# EAGLE design Modulo_shield_L6470-28 (EAGLE 7.6.0)
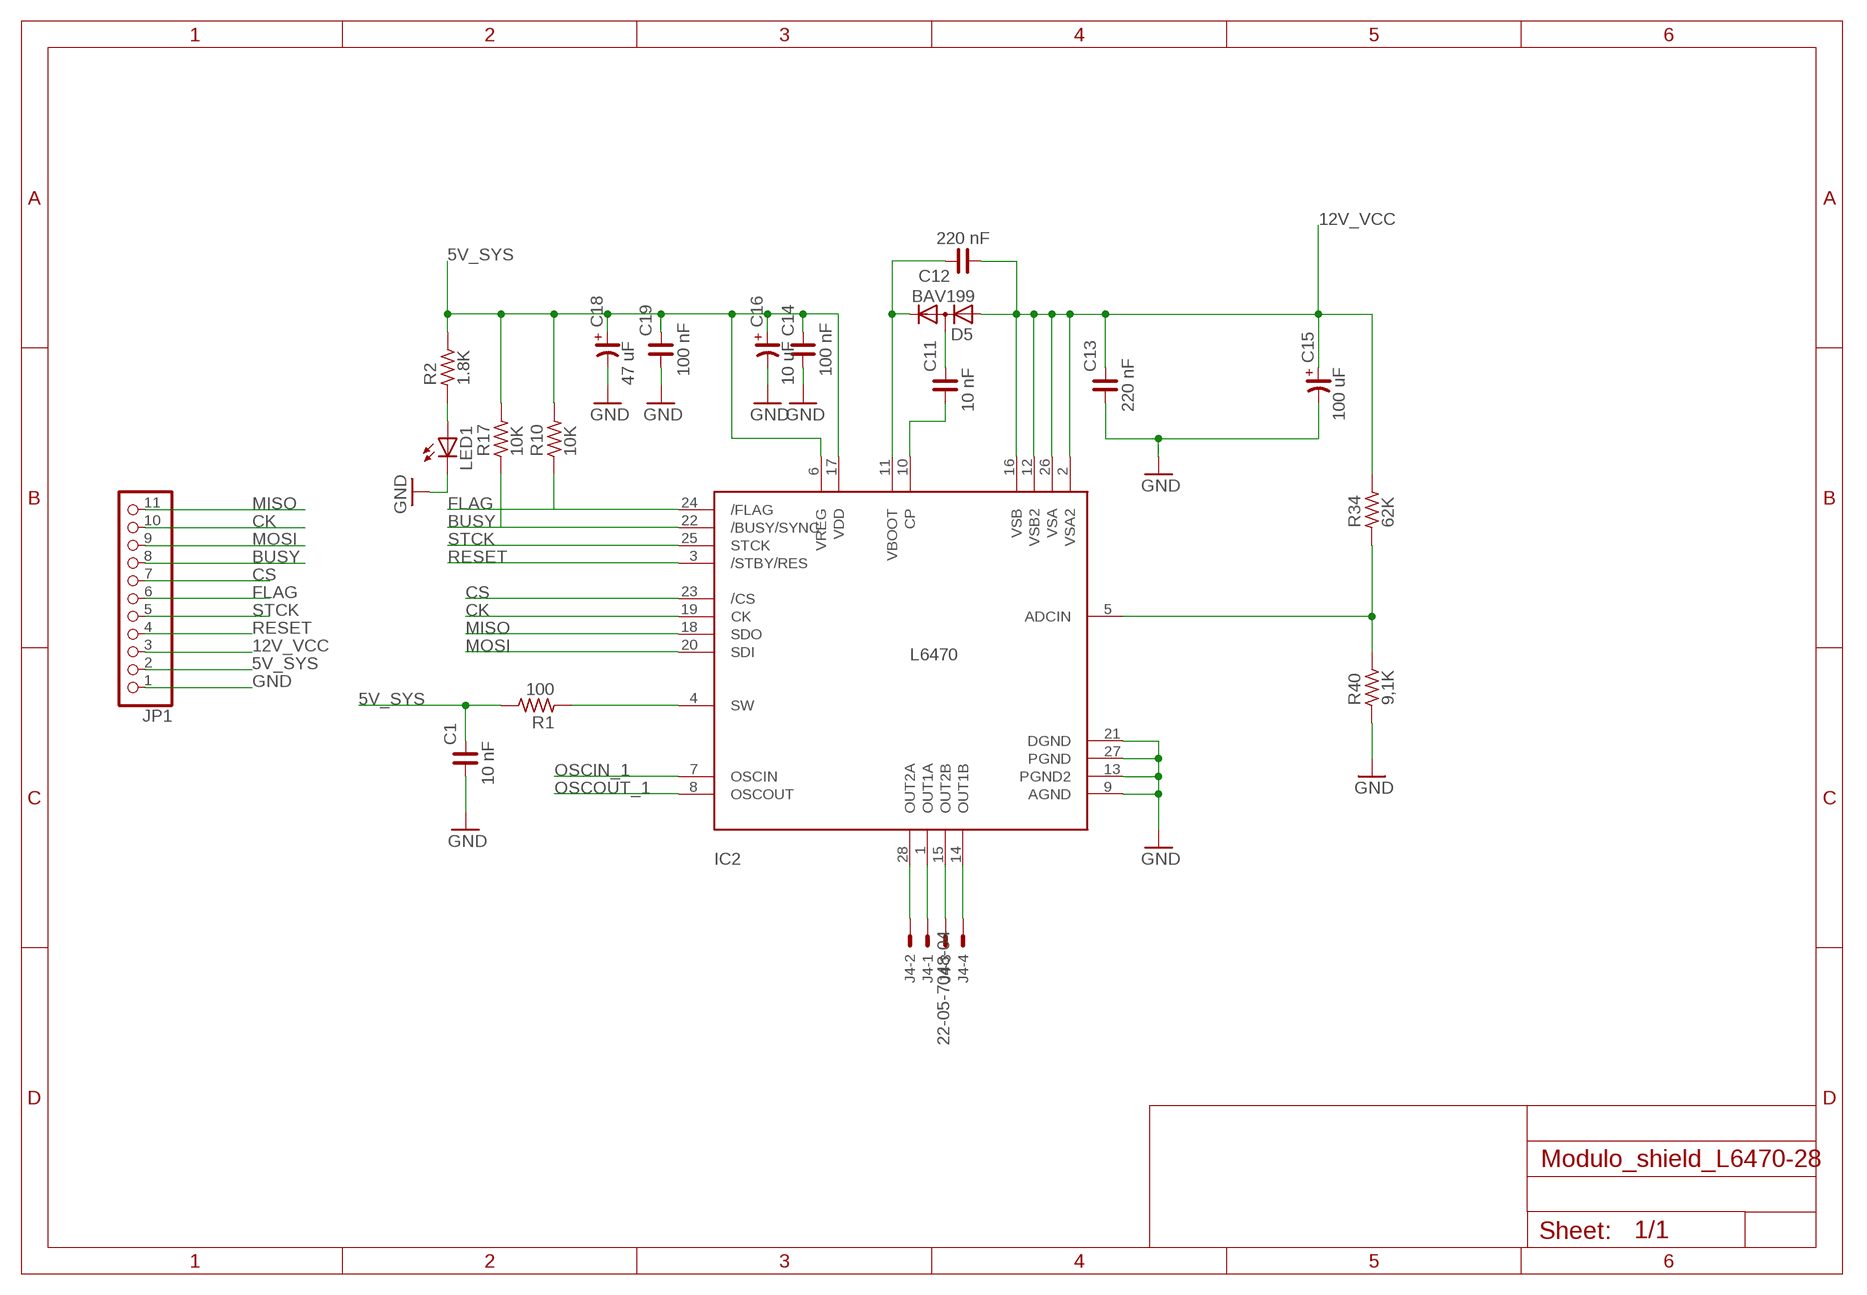
[diagram p0: schematic, sheet 1]

## Parts
C1  10 nF  C_1206  [C1206]
C11  10 nF  C_1206  [C1206]
C12  220 nF  C_1206  [C1206]
C13  220 nF  C_1206  [C1206]
C14  100 nF  C_1206  [C1206]
C15  100 uF  CP_SV-D  [CSV-D]
C16  10 uF  CP_SV-B  [CSV-B]
C18  47 uF  CP_SV-B  [CSV-B]
C19  100 nF  C_1206  [C1206]
D5  BAV199  [SOT23]
IC2  L6470  [HTSSOP28]
J4  22-05-7048-04  [7395-04]
JP1  PINHD-1X11/90  [1X11/90]
LED1  LEDCHIPLED_1206  [CHIPLED_1206]
R1  100  R_1206  [R1206]
R2  1.8K  R_1206  [R1206]
R10  10K  R_1206  [R1206]
R17  10K  R_1206  [R1206]
R34  62K  R_1206  [R1206]
R40  9,1K  R_1206  [R1206]

## Nets
5V_SYS: C1.2 C14.2 C16.+ C18.+ C19.2 IC2.6(VREG) IC2.17(VDD) JP1.2 R1.2 R2.2 R10.2 R17.2
12V_VCC: C12.1 C13.2 C15.+ D5.1(A) IC2.2(VSA2) IC2.12(VSB2) IC2.16(VSB) IC2.26(VSA) JP1.3 R34.2
A1: IC2.1(OUT1A) J4.1
A2: IC2.28(OUT2A) J4.2
BUSY: IC2.22(/BUSY/SYNC) JP1.8 R17.1
CK: IC2.19(CK) JP1.10
CS: IC2.23(/CS) JP1.7
FLAG: IC2.24(/FLAG) JP1.6 R10.1
GND: C1.1 C13.1 C14.1 C15.- C16.- C18.- C19.1 IC2.9(AGND) IC2.13(PGND2) IC2.21(DGND) IC2.27(PGND) JP1.1 LED1.C R40.1
MISO: IC2.18(SDO) JP1.11
MOSI: IC2.20(SDI) JP1.9
N$1: IC2.4(SW) R1.1
N$2: IC2.15(OUT2B) J4.3
N$3: IC2.14(OUT1B) J4.4
N$5: C11.2 D5.3(AC)
N$7: C11.1 IC2.10(CP)
N$16: LED1.A R2.1
N$48: IC2.5(ADCIN) R34.1 R40.2
OSCIN_1: IC2.7(OSCIN)
OSCOUT_1: IC2.8(OSCOUT)
RESET: IC2.3(/STBY/RES) JP1.4
STCK: IC2.25(STCK) JP1.5
VBOOT_1: C12.2 D5.2(C) IC2.11(VBOOT)

## Library data of the parts
C1 C11-C14 C19 = tesis-master-smd:C_: NON-POLARIZED CAP
C15 C16 C18 = tesis-master-smd:CP_: POLARIZED CAP
D5 = diode:BAV199: DIODE low-leakage double diode
IC2 = tesis-Reprap:L6470: Fully integrated microstepping motor driver with motion engine and SPI
J4 = tesis-Replicape_B3:22-?-04: CONNECTOR wire to board 2.54 mm (.1 inch) pitch header; OC_FARNELL: unknown; OC_NEWARK: unknown
JP1 = pinhead:PINHD-1X11: PIN HEADER
LED1 = tesis-Replicape_B3:LED: LED OSRAM: - CHIPLED LG R971, LG N971, LY N971, LG Q971, LY Q971, LO R971, LY R971 LH N974, LH R974 LS Q976, LO Q976, LY Q976 LO Q996 - Hyper CHIPLED LW Q18S LB Q993, LB Q99A, LB R99A - SideLED LS A670, LO A670, LY A670, LG A670, LP A670 LB A673, LV A673, LT A673, LW A673 LH A674 LY A675 LS A676, LA A676, LO A676, LY A676, LW A676 LS A679, LY A679, LG A679 - Hyper Micro SIDELED® LS Y876, LA Y876, LO Y876, LY Y876 LT Y87S - SmartLED LW L88C, LW L88S LB L89C, LB L89S, LG L890 LS L89K, LO L89K, LY L89K LS L896, LA L896, LO L896, LY L896 - TOPLED LS T670, LO T670, LY T670, LG T670, LP T670 LSG T670, LSP T670, LSY T670, LOP T670, LYG T670 LG T671, LOG T671, LSG T671 LB T673, LV T673, LT T673, LW T673 LH T674 LS T676, LA T676, LO T676, LY T676, LB T676, LH T676, LSB T676, LW T676 LB T67C, LV T67C, LT T67C, LS T67K, LO T67K, LY T67K, LW E67C LS E67B, LA E67B, LO E67B, LY E67B, LB E67C, LV E67C, LT E67C LW T67C LS T679, LY T679, LG T679 LS T770, LO T770, LY T770, LG T770, LP T770 LB T773, LV T773, LT T773, LW T773 LH T774 LS E675, LA E675, LY E675, LS T675 LS T776, LA T776, LO T776, LY T776, LB T776 LHGB T686 LT T68C, LB T68C - Hyper Mini TOPLED® LB M676 - Mini TOPLED Santana® LG M470 LS M47K, LO M47K, LY M47K Source: http://www.osram.convergy.de LUXEON: - LUMILED® LXK2-PW12-R00, LXK2-PW12-S00, LXK2-PW14-U00, LXK2-PW14-V00 LXK2-PM12-R00, LXK2-PM12-S00, LXK2-PM14-U00 LXK2-PE12-Q00, LXK2-PE12-R00, LXK2-PE12-S00, LXK2-PE14-T00, LXK2-PE14-U00 LXK2-PB12-K00, LXK2-PB12-L00, LXK2-PB12-M00, LXK2-PB14-N00, LXK2-PB14-P00, LXK2-PB14-Q00 LXK2-PR12-L00, LXK2-PR12-M00, LXK2-PR14-Q00, LXK2-PR14-R00 LXK2-PD12-Q00, LXK2-PD12-R00, LXK2-PD12-S00 LXK2-PH12-R00, LXK2-PH12-S00 LXK2-PL12-P00, LXK2-PL12-Q00, LXK2-PL12-R00 Source: www.luxeon.com KINGBRIGHT: KA-3528ASYC Source: www.kingbright.com
R1 R2 R10 R17 R34 R40 = tesis-master-smd:R_: RESISTOR

## Board
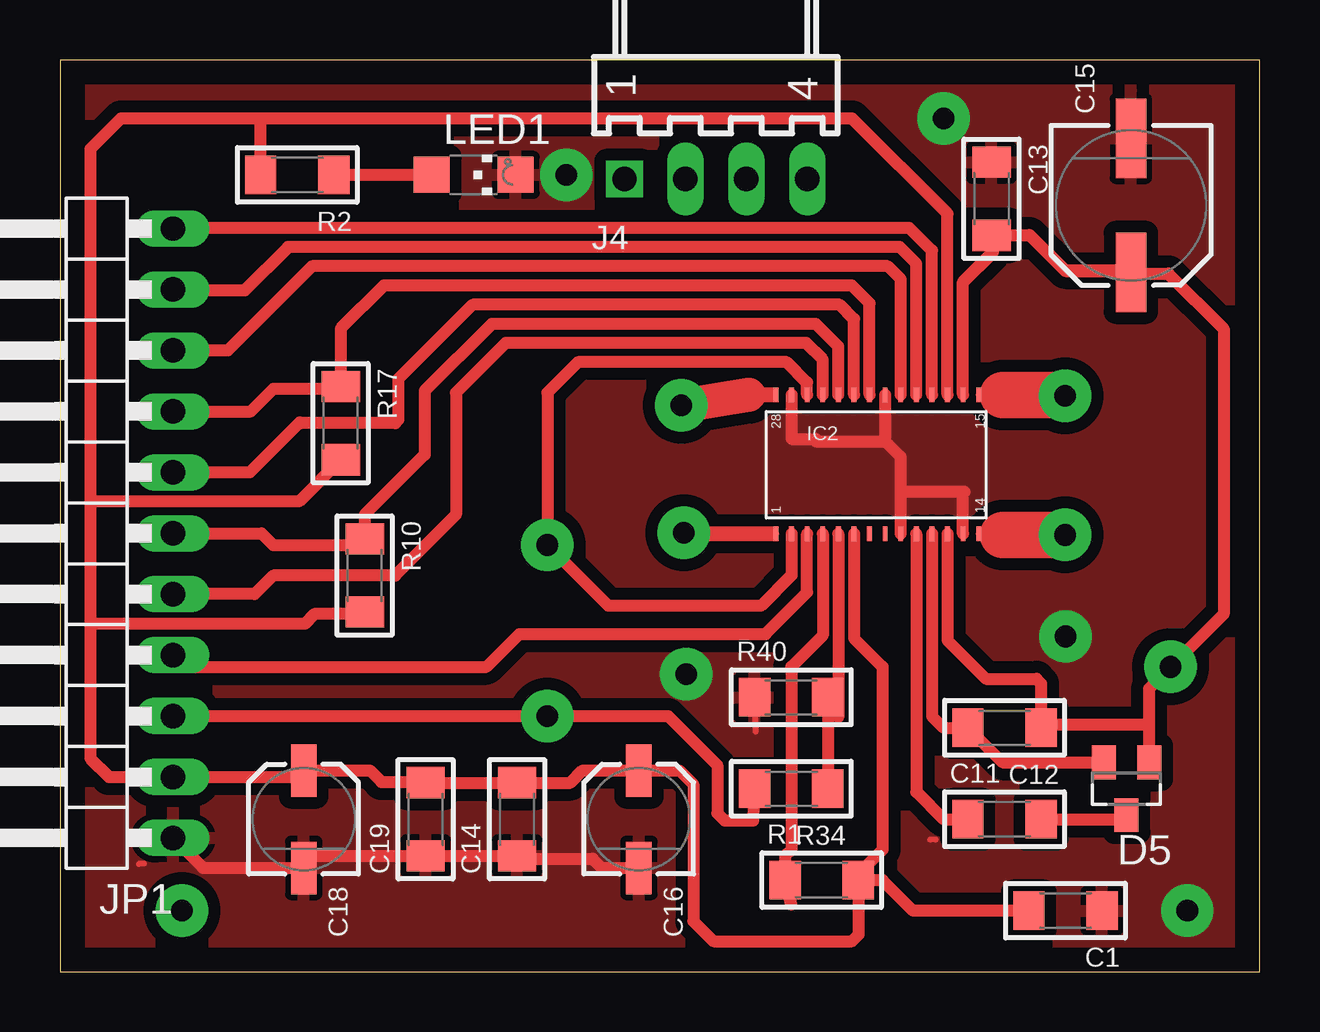
[diagram p1: board, top side]
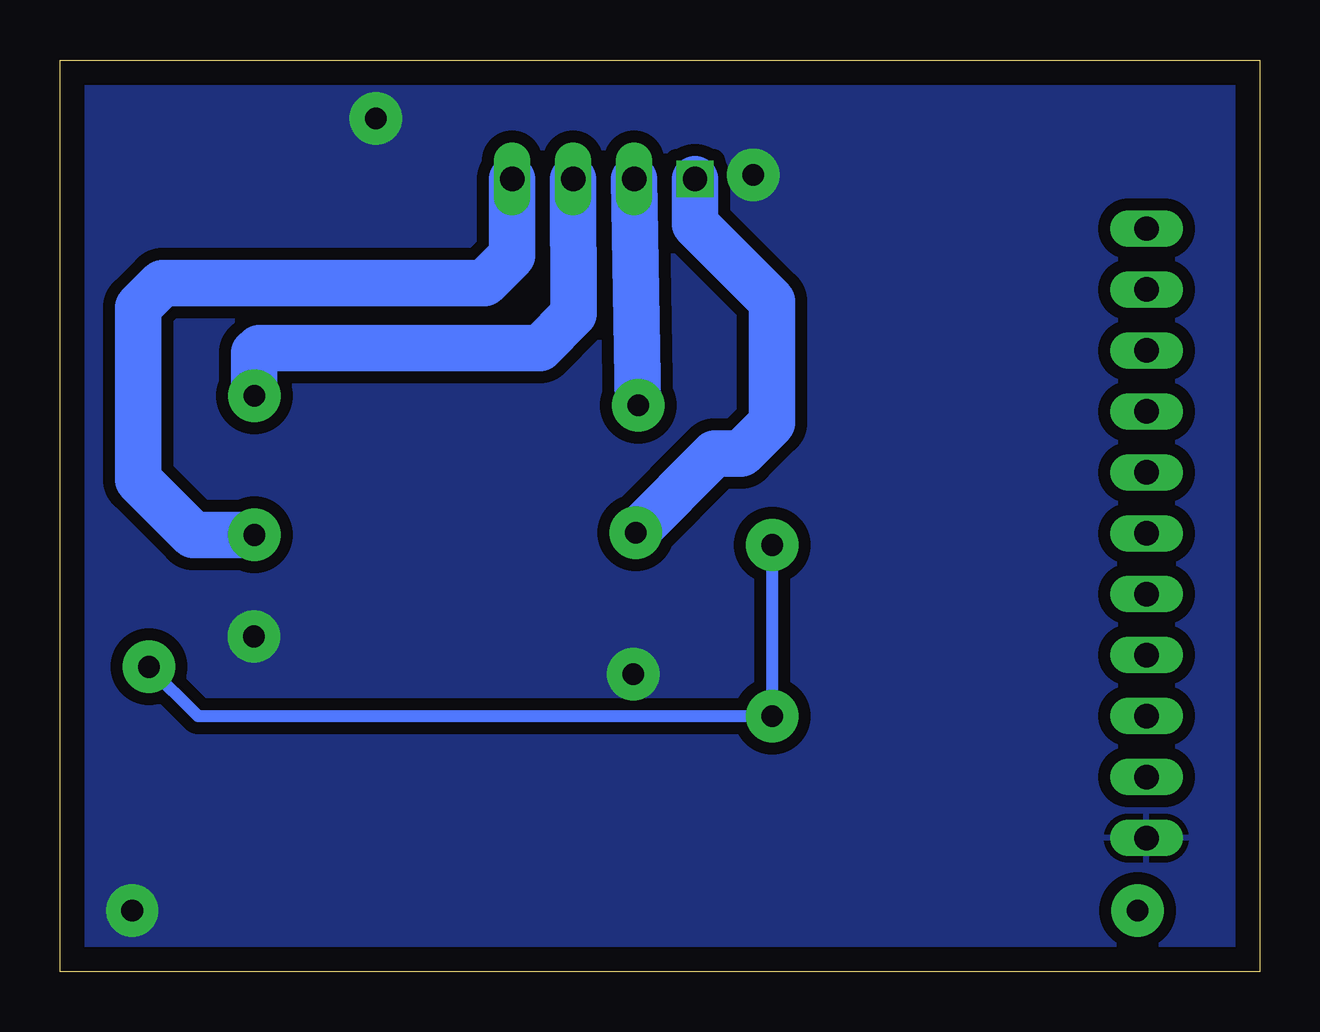
[diagram p2: board, bottom side, seen from below]

Size 50 x 38 mm. Coordinates in mm from the lower left corner, seen from the top.
Outline: 0,0 50,0 50,38 0,38 0,0
Copper layers (1*16): Top 0.035mm / dielectric 1.5mm / Bottom 0.035mm
Design rules "default *": minimum track width 10mil, minimum drill 24mil, track to track 0.5mm, track to pad 0.5mm, pad to pad 0.5mm, via to via 0.5mm, smd to smd 0.5mm, copper to edge 40mil, drill to drill 8mil, minimum pad ring 10mil, minimum via ring 8mil, stop-mask expansion 4mil, vias tented up to drill 0mil, thermal gap 10mil

### Footprints (pad centres in the part's own frame; a part is rotated, then mirrored left to right if it is on the bottom)
C1206 = smd 1.3 x 1.6: 1 -1.524,0; 2 1.524,0
CSV-D = smd 3.302 x 1.27: + -2.794,0; - 2.794,0
CSV-B = smd 2.184 x 1.067: + -2.032,0; - 2.032,0
SOT23 = smd 1 x 1.4: 1 -0.95,-1.1; 2 0.95,-1.1; 3 0,1.1
HTSSOP28 = smd 0.2 x 0.6: 1 -4.445,-3.26; 2 -3.795,-3.26; 3 -3.145,-3.26; 4 -2.495,-3.26; 5 -1.845,-3.26; 6 -1.195,-3.26; 7 -0.545,-3.26; 8 0.105,-3.26; 9 0.755,-3.26; 10 1.405,-3.26; 11 2.055,-3.26; 12 2.705,-3.26; 13 3.355,-3.26; 14 4.005,-3.26; 15 4.005,2.54; 16 3.355,2.54; 17 2.705,2.54; 18 2.055,2.54; 19 1.405,2.54; 20 0.755,2.54; 21 0.105,2.54; 22 -0.545,2.54; 23 -1.195,2.54; 24 -1.845,2.54; 25 -2.495,2.54; 26 -3.145,2.54; 27 -3.795,2.54; 28 -4.445,2.54
7395-04 = drill 1.016 square: 1 3.81,0 | drill 1.016 long: 2 1.27,0; 3 -1.27,0; 4 -3.81,0
1X11/90 = drill 1.016 long: 1 -12.7,-3.81; 2 -10.16,-3.81; 3 -7.62,-3.81; 4 -5.08,-3.81; 5 -2.54,-3.81; 6 0,-3.81; 7 2.54,-3.81; 8 5.08,-3.81; 9 7.62,-3.81; 10 10.16,-3.81; 11 12.7,-3.81
CHIPLED_1206 = smd 1.5 x 1.5: A 0,-1.75; C 0,1.75
R1206 = smd 1.3 x 1.6: 1 -1.524,0; 2 1.524,0

### Placement (x,y rotation side)
C1  41.91,2.54 180 top
C11  39.37,6.35 0 top
C12  39.37,10.16 180 top
C13  38.83,32.21 270 top
C14  19.05,6.35 90 top
C15  44.64,31.94 90 top
C16  24.13,6.35 270 top
C18  10.16,6.35 270 top
C19  15.24,6.35 90 top
D5  44.45,7.62 180 top
IC2  34.29,21.51 0 top
J4  27.34,33.04 180 top
JP1  0.9,18.27 90 top
LED1  17.24,33.21 270 top
R1  31.75,3.81 0 top
R2  9.89,33.21 180 top
R10  12.7,16.51 270 top
R17  11.7,22.86 270 top
R34  30.48,7.62 180 top
R40  30.48,11.43 0 top

### Tracks (layer width: path | path; a pad name or v marks a point on that pad's centre or on a via)
5V_SYS
  Top 0.5: IC2.6 33.09,13.89 34.29,12.7 34.29,5.08 33.27,4.06 R1.2 | R1.2 33.3,2.51 33.3,1.55 33.02,1.27 27.23,1.27 26.4,2.1 26.4,7.8 25.82,8.38 C16.+ 21.78,8.38 21.27,7.87 C14.2 C19.2 15.21,7.9 13.4,7.9 12.92,8.38 C18.+ 10.16,8.11 JP1.2 2.05,8.11 1.27,8.89 1.27,14.5 | 1.27,19.6 1.27,34.29 2.54,35.56 8.37,35.56 | 1.27,19.6 1.27,14.5 | R10.2 12.61,14.9 10.6,14.9 10.2,14.5 1.27,14.5 | R17.2 9.96,19.6 1.27,19.6 | IC2.17 36.99,31.59 33.02,35.56 8.37,35.56 | R2.2 8.37,35.56 | C1.2 35.56,2.54 34.29,3.81 R1.2
12V_VCC  (via drill 0.9 pad 2.18)
  Top 0.5: C15.+ 44.56,29.21 41.91,29.21 40.43,30.69 C13.2 38.83,29.94 37.65,28.75 IC2.16 37.65,28.75 38.9,30 38.9,30.7 40.4,30.7 41.9,29.2 44.7,29.2 44.8,29.1 46.2,29.1 48.5,26.8 48.5,14.9 v46.3,12.7 45.4,11.8 45.4,10.3 | JP1.3 v20.32,10.65 25.35,10.65 27.4,8.6 27.4,6.6 27.7,6.3 28.91,6.3 R34.2 | IC2.26 31.14,24.55 30.3,25.4 21.59,25.4 20.32,24.13 v20.32,17.78 22.86,15.24 29.21,15.24 30.5,16.52 IC2.2 | IC2.12 36.99,13.8 38.6,12.2 40.7,12.2 40.89,12.01 C12.1 41.03,10.3 45.4,10.3 | D5.1 45.4,10.3
  Bottom 0.5: v20.32,17.78 v20.32,10.65 44.25,10.65 v46.3,12.7
A1  (via drill 0.9 pad 2.18)
  Top 0.254: IC2.1 v26,18.3
  Bottom 1.93: v26,18.3 22.71,21.59 21.59,21.59 20.32,22.86 20.32,27.94 23.53,31.15 J4.1
A2  (via drill 0.9 pad 2.18)
  Top 0: IC2.28 28.7,24.05 26.1,24.05 v25.9,23.6
  Top 1.422: v25.9,23.6 28.7,24.05
  Bottom 1.93: J4.2 v25.9,23.6
BUSY
  Top 0.5: IC2.22 33.74,27.86 33,28.6 13.5,28.6 11.7,26.8 R17.1 | R17.1 11.68,24.4 | 11.4,24.68 R17.1 | JP1.8 7.95,23.35 8.9,24.3 11.62,24.3 R17.1
CK
  Top 0.5: IC2.19 35.7,29.5 35,30.2 9.5,30.2 7.7,28.4 4.74,28.4 JP1.10
CS
  Top 0.5: IC2.23 33.09,27.2 32.5,27.8 17.2,27.8 14.1,24.7 14.1,22.99 13.97,22.86 10.04,22.86 10,22.9 7.91,20.81 JP1.7
FLAG
  Top 0.5: IC2.24 32.45,26.05 31.5,27 18,27 15.2,24.2 15.2,21.55 12.7,19.05 R10.1 12.45,17.78 8.89,17.78 8.4,18.27 JP1.6
GND  (via drill 0.9 pad 2.18)
  Top 0.254: 29,10 R40.1 | 36.5,5.5 36.26,5.5 | 3.5,4.5 3.28,4.49
  Top 0.5: IC2.27 30.5,22.2 31.5,22.2 31.5,22.1 34.4,22.1 | 34.4,22.1 IC2.21 | IC2.9 35.05,20 | 35.05,20 35.05,21.45 34.4,22.1 | IC2.13 37.65,19.95 37.7,20 35.05,20 | JP1.1 5.96,4.32 C18.- 10.16,4.83 C19.1 C14.1 19.05,4.7 22.2,4.7 22.58,4.32 C16.-
  other vias: 41.91,13.97 26.1,12.4 46.99,2.54 36.83,35.56 21.1,33.2
  pour Top: 31.3,22.5 43.1,22.5 43.1,21.9 36.8,21.9 36.8,21.3 43.1,21.3 43.1,20.8 36.8,20.8 36.8,20.4 36.8,20.3 36.8,20.2 43.1,20.2 43.1,19.8 25.1,19.8 25.1,20.3 31.3,20.3 31.3,20.8 25.1,20.8 25.1,21.3 31.3,21.3 31.3,21.9 25.1,21.9 25.1,22.4 31.3,22.4
  pour Top: -1.27,-1.27 50.8,-1.27 50.8,39.37 -1.27,39.37
  pour Bottom: -1.27,-1.27 50.8,-1.27 50.8,39.37 -1.27,39.37
MISO
  Top 0.5: IC2.18 36.34,30.05 35.4,31 4.74,31 JP1.11
MOSI
  Top 0.5: IC2.20 35.05,28.86 34.5,29.4 10.5,29.4 7,25.9 JP1.9
N$1
  Top 0.5: IC2.4 31.8,14.02 30.48,12.7 30.48,5.08 30.23,4.83 R1.1 30.48,2.79
N$2  (via drill 0.9 pad 2.18)
  Top 0.254: IC2.15 39.3,24.04 v41.9,24
  Top 1.93: v41.9,24 41.86,24.04 39.3,24.04
  Bottom 1.93: J4.3 28.6,27.4 30,26 41.7,26 41.9,25.8 v41.9,24
N$3  (via drill 0.9 pad 2.18)
  Top 0.254: IC2.14 v41.9,18.2
  Top 1.93: 39.3,18.2 v41.9,18.2
  Bottom 1.93: J4.4 31.15,29.85 32.3,28.7 45.74,28.7 46.74,27.7 46.74,20.5 44.44,18.2 v41.9,18.2
N$4  (via drill 0.9 pad 2.18)
  other vias: 5.08,2.54
N$5
  Top 0.5: C11.2 44.28,6.35 D5.3
N$7
  Top 0.5: IC2.10 35.7,7.49 36.83,6.35 C11.1
N$16
  Top 0.5: R2.1 LED1.A
N$48
  Top 0.5: IC2.5 32.45,10.6 R40.2 R34.1
RESET
  Top 0.5: JP1.4 5.2,12.7 17.78,12.7 19.15,14.07 29.41,14.07 31.14,15.8 IC2.3
STCK
  Top 0.5: IC2.25 31.8,25.5 31.1,26.2 18.58,26.2 16.51,24.13 16.51,19.05 13.97,16.51 8.89,16.51 8.11,15.73 JP1.5
VBOOT_1
  Top 0.5: IC2.11 36.34,10.64 36.83,10.16 C12.2 39.29,8.72 D5.2
(copper drawn outside any net)
  shapes: Top area x8